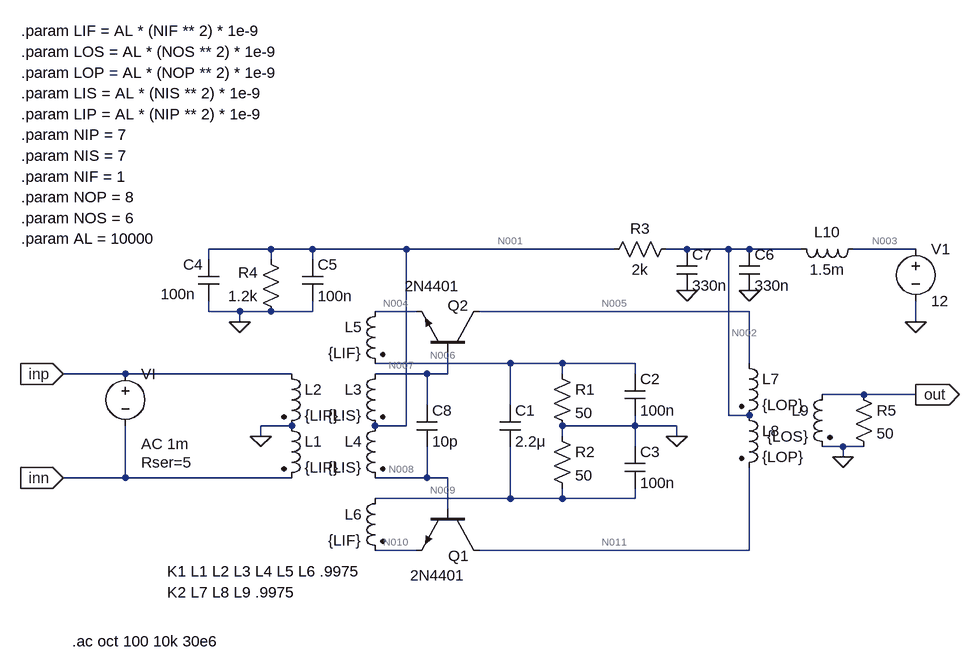
[diagram p0: schematic magnetic loop antenna.asc]
magnetic loop antenna.asc, the LTspice schematic file:
Version 4
SHEET 1 992 680
WIRE -96 -80 -192 -80
WIRE -32 -80 -96 -80
WIRE 112 -80 -32 -80
WIRE 432 -80 112 -80
WIRE 544 -80 512 -80
WIRE 608 -80 544 -80
WIRE 640 -80 608 -80
WIRE 720 -80 640 -80
WIRE 896 -80 800 -80
WIRE -192 -64 -192 -80
WIRE -96 -64 -96 -80
WIRE -32 -64 -32 -80
WIRE -192 16 -192 0
WIRE -144 16 -192 16
WIRE -96 16 -144 16
WIRE -32 16 -32 0
WIRE -32 16 -96 16
WIRE 128 16 64 16
WIRE 640 16 224 16
WIRE -144 32 -144 16
WIRE 896 32 896 0
WIRE 272 96 64 96
WIRE 352 96 272 96
WIRE 464 96 352 96
WIRE 640 96 640 16
WIRE -320 112 -416 112
WIRE -64 112 -320 112
WIRE 144 112 64 112
WIRE 176 112 176 80
WIRE 176 112 144 112
WIRE 352 112 352 96
WIRE 464 112 464 96
WIRE 816 144 752 144
WIRE 896 144 816 144
WIRE 144 160 144 112
WIRE 272 160 272 96
WIRE 608 176 608 -80
WIRE 640 176 608 176
WIRE -64 192 -112 192
WIRE 112 192 112 -80
WIRE 112 192 64 192
WIRE 464 192 464 176
WIRE 464 192 352 192
WIRE 528 192 464 192
WIRE -112 208 -112 192
WIRE 352 208 352 192
WIRE 528 208 528 192
WIRE 464 224 464 192
WIRE 784 224 752 224
WIRE 816 224 784 224
WIRE 784 240 784 224
WIRE -320 272 -320 192
WIRE -320 272 -416 272
WIRE -64 272 -320 272
WIRE 144 272 144 224
WIRE 144 272 64 272
WIRE 176 272 144 272
WIRE 272 304 272 224
WIRE 272 304 64 304
WIRE 352 304 352 288
WIRE 352 304 272 304
WIRE 464 304 464 288
WIRE 464 304 352 304
WIRE 176 320 176 272
WIRE 128 384 64 384
WIRE 640 384 640 256
WIRE 640 384 224 384
FLAG 528 208 0
FLAG -112 208 0
FLAG -144 32 0
FLAG 640 -16 0
FLAG 544 -16 0
FLAG 896 32 0
FLAG 784 240 0
FLAG -416 112 inp
IOPIN -416 112 In
FLAG -416 272 inn
IOPIN -416 272 In
FLAG 896 144 out
IOPIN 896 144 Out
SYMBOL ind2 -80 176 R0
SYMATTR InstName L1
SYMATTR Value {LIP}
SYMATTR Type ind
SYMBOL ind2 -80 96 R0
SYMATTR InstName L2
SYMATTR Value {LIP}
SYMATTR Type ind
SYMBOL ind2 80 96 M0
SYMATTR InstName L3
SYMATTR Value {LIS}
SYMATTR Type ind
SYMBOL ind2 80 176 M0
SYMATTR InstName L4
SYMATTR Value {LIS}
SYMATTR Type ind
SYMBOL ind2 80 0 M0
SYMATTR InstName L5
SYMATTR Value {LIF}
SYMATTR Type ind
SYMBOL ind2 80 288 M0
SYMATTR InstName L6
SYMATTR Value {LIF}
SYMATTR Type ind
SYMBOL npn 224 320 R90
WINDOW 0 72 15 VRight 2
WINDOW 3 102 21 VRight 2
SYMATTR InstName Q1
SYMATTR Value 2N4401
SYMBOL npn 224 80 M270
WINDOW 0 73 48 VLeft 2
WINDOW 3 103 114 VLeft 2
SYMATTR InstName Q2
SYMATTR Value 2N4401
SYMBOL cap 256 160 R0
SYMATTR InstName C1
SYMATTR Value 2.2μ
SYMBOL res 336 96 R0
SYMATTR InstName R1
SYMATTR Value 50
SYMBOL res 336 192 R0
SYMATTR InstName R2
SYMATTR Value 50
SYMBOL cap 448 112 R0
SYMATTR InstName C2
SYMATTR Value 100n
SYMBOL cap 448 224 R0
SYMATTR InstName C3
SYMATTR Value 100n
SYMBOL ind2 624 80 R0
SYMATTR InstName L7
SYMATTR Value {LOP}
SYMATTR Type ind
SYMBOL ind2 624 160 R0
SYMATTR InstName L8
SYMATTR Value {LOP}
SYMATTR Type ind
SYMBOL ind2 768 128 M0
SYMATTR InstName L9
SYMATTR Value {LOS}
SYMATTR Type ind
SYMBOL ind 816 -96 R90
WINDOW 0 5 56 VBottom 2
WINDOW 3 32 56 VTop 2
SYMATTR InstName L10
SYMATTR Value 1.5m
SYMBOL voltage 896 -96 R0
SYMATTR InstName V1
SYMATTR Value 12
SYMBOL res 528 -96 R90
WINDOW 0 0 56 VBottom 2
WINDOW 3 32 56 VTop 2
SYMATTR InstName R3
SYMATTR Value 2k
SYMBOL res -80 32 R180
WINDOW 0 36 76 Left 2
WINDOW 3 36 40 Left 2
SYMATTR InstName R4
SYMATTR Value 1.2k
SYMBOL cap -208 -64 R0
WINDOW 0 -23 8 Left 2
WINDOW 3 -58 53 Left 2
SYMATTR InstName C4
SYMATTR Value 100n
SYMBOL cap -48 -64 R0
SYMATTR InstName C5
SYMATTR Value 100n
SYMBOL cap 624 -80 R0
SYMATTR InstName C6
SYMATTR Value 330n
SYMBOL cap 528 -80 R0
SYMATTR InstName C7
SYMATTR Value 330n
SYMBOL voltage -320 96 R0
WINDOW 123 24 124 Left 2
WINDOW 39 24 152 Left 2
SYMATTR InstName VI
SYMATTR Value ""
SYMATTR Value2 AC 1m
SYMATTR SpiceLine Rser=5
SYMBOL res 800 128 R0
SYMATTR InstName R5
SYMATTR Value 50
SYMBOL cap 128 160 R0
SYMATTR InstName C8
SYMATTR Value 10p
TEXT -256 416 Left 2 !K1 L1 L2 L3 L4 L5 L6 .9975
TEXT -256 448 Left 2 !K2 L7 L8 L9 .9975
TEXT -480 -256 Left 2 !.param NIP = 7
TEXT -480 -224 Left 2 !.param NIS = 7
TEXT -480 -192 Left 2 !.param NIF = 1
TEXT -480 -160 Left 2 !.param NOP = 8
TEXT -480 -128 Left 2 !.param NOS = 6
TEXT -480 -96 Left 2 !.param AL = 10000
TEXT -480 -288 Left 2 !.param LIP = AL * (NIP ** 2) * 1e-9
TEXT -480 -320 Left 2 !.param LIS = AL * (NIS ** 2) * 1e-9
TEXT -480 -352 Left 2 !.param LOP = AL * (NOP ** 2) * 1e-9
TEXT -480 -384 Left 2 !.param LOS = AL * (NOS ** 2) * 1e-9
TEXT -402 524 Left 2 !.ac oct 100 10k 30e6
TEXT -480 -416 Left 2 !.param LIF = AL * (NIF ** 2) * 1e-9

The netlist it stands for:
* magnetic loop antenna.asc
L1 0 inn {LIP}
L2 inp 0 {LIP}
L3 N007 N001 {LIS}
L4 N001 N008 {LIS}
L5 N004 N006 {LIF}
L6 N009 N010 {LIF}
Q1 N011 N008 N010 0 2N4401
Q2 N005 N007 N004 0 2N4401
C1 N006 N009 2.2μ
R1 N006 0 50
R2 0 N009 50
C2 N006 0 100n
C3 0 N009 100n
L7 N005 N002 {LOP}
L8 N002 N011 {LOP}
L9 out 0 {LOS}
L10 N003 N002 1.5m
V1 N003 0 12
R3 N002 N001 2k
R4 0 N001 1.2k
C4 N001 0 100n
C5 N001 0 100n
C6 N002 0 330n
C7 N002 0 330n
VI inp inn AC 1m Rser=5
R5 out 0 50
C8 N007 N008 10p
.model NPN NPN
.model PNP PNP
.lib standard.bjt
K1 L1 L2 L3 L4 L5 L6 .9975
K2 L7 L8 L9 .9975
.param NIP = 7
.param NIS = 7
.param NIF = 1
.param NOP = 8
.param NOS = 6
.param AL = 10000
.param LIP = AL * (NIP ** 2) * 1e-9
.param LIS = AL * (NIS ** 2) * 1e-9
.param LOP = AL * (NOP ** 2) * 1e-9
.param LOS = AL * (NOS ** 2) * 1e-9
.ac oct 100 10k 30e6
.param LIF = AL * (NIF ** 2) * 1e-9
.backanno
.end

* Results of the author's LTspice run, read from the files saved beside the schematic
* Operating Point, zero values left out:
*   V(n007) = 4.053 V
*   V(n001) = 4.053 V
*   V(n008) = 4.053 V
*   V(n004) = 3.307 V
*   V(n006) = 3.307 V
*   V(n009) = 3.307 V
*   V(n010) = 3.307 V
*   V(n011) = 12 V
*   V(n005) = 12 V
*   V(n002) = 12 V
*   V(n003) = 12 V
*   Ic(Q2) = 65.84 mA
*   Ib(Q2) = 297.8 µA
*   Ie(Q2) = -66.14 mA
*   Ic(Q1) = 65.84 mA
*   Ib(Q1) = 297.8 µA
*   Ie(Q1) = -66.14 mA
*   I(L10) = 135.7 mA
*   I(L8) = 65.84 mA
*   I(L7) = -65.84 mA
*   I(L6) = -66.14 mA
*   I(L5) = 66.14 mA
*   I(L4) = 297.8 µA
*   I(L3) = -297.8 µA
*   I(R4) = -3.378 mA
*   I(R3) = 3.973 mA
*   I(R2) = -66.14 mA
*   I(R1) = 66.14 mA
*   I(V1) = -135.7 mA
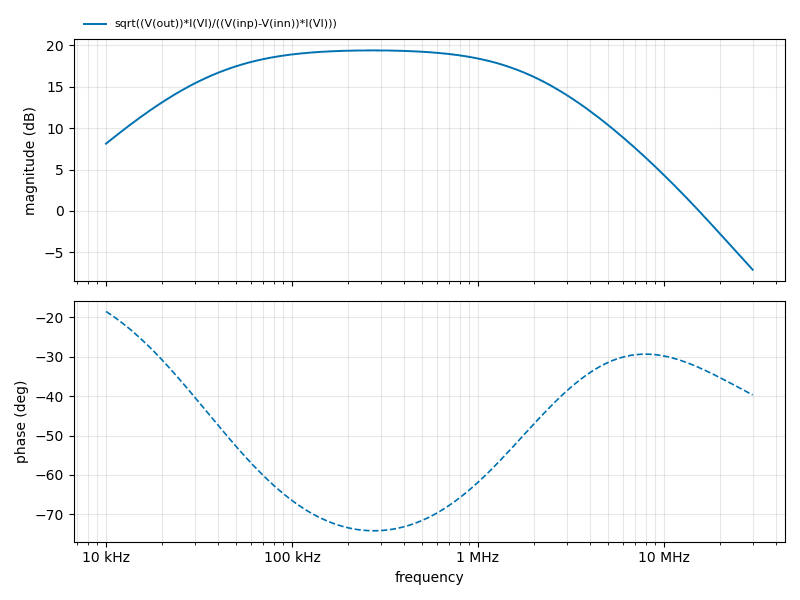
[diagram p1: AC Analysis of magnetic loop antenna.asc, plotted from the saved traces]
* AC Analysis, 1 run:
*   sqrt((V(out))*I(VI)/((V(inp)-V(inn))*I(VI))): 8.13 dB at 10 kHz, -7.10 dB at 30 MHz, peak 19.40 dB at 271 kHz, 3 dB below the peak at 37.1 kHz and 1.914 MHz